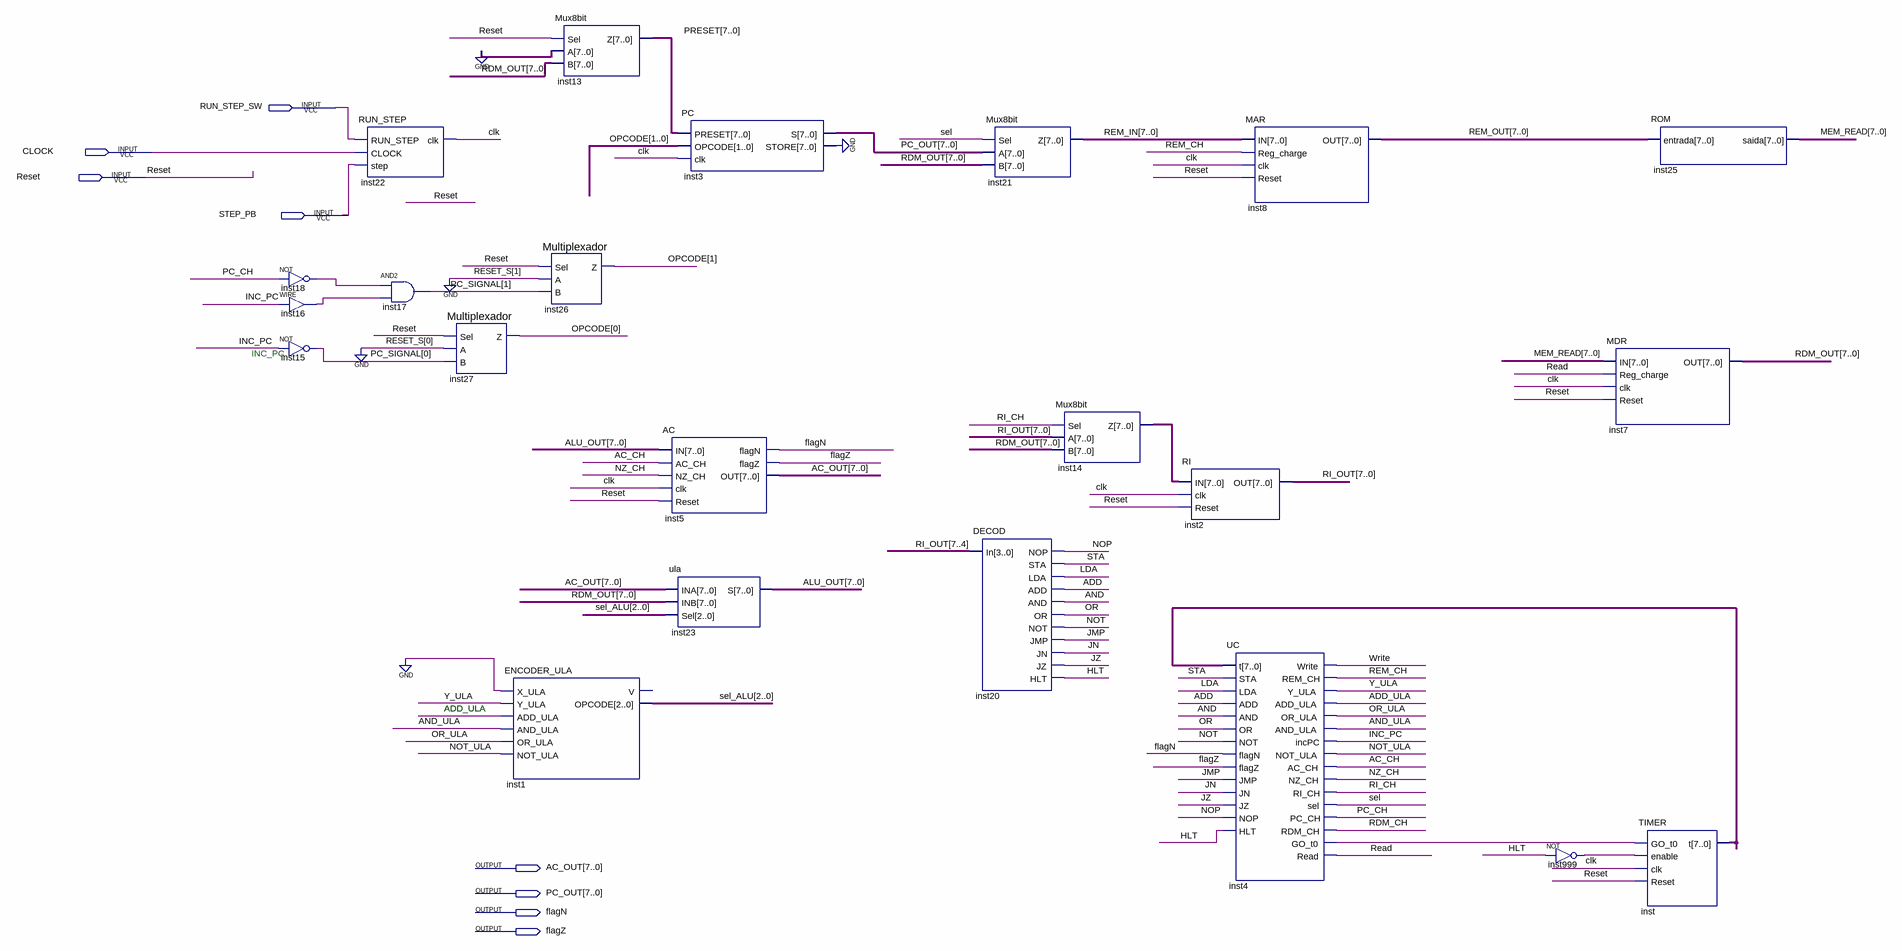
[diagram p0: schematic sheet]
// Quartus schematic NEANDER.bdf as structural Verilog: 22 symbols, 8 pins
module NEANDER (
  input  RUN_STEP_SW,
  input  CLOCK,
  input  Reset,
  input  STEP_PB,
  output [7:0] AC_OUT,
  output [7:0] PC_OUT,
  output flagN,
  output flagZ
);

  wire AC_CH, ADD, ADD_ULA, AND, AND_ULA, clk, HLT, INC_PC, inst4_go_t0, inst16_out, inst18_out, inst999_out,
       JMP, JN, JZ, LDA, NOP, NOT, NOT_ULA, NZ_CH, OR, OR_ULA, PC_CH, RDM_CH, Read, REM_CH, RI_CH, sel, STA,
       Write, Y_ULA;
  wire [1:0] OPCODE, PC_SIGNAL;
  wire [2:0] sel_ALU;
  wire [7:0] ALU_OUT, inst3_store, inst14_z, inst_t, MEM_READ, PRESET, RDM_OUT, REM_IN, REM_OUT, RI_OUT;

  not inst18 (inst18_out, PC_CH);
  assign inst16_out = INC_PC;  // WIRE inst16
  not inst15 (PC_SIGNAL[0], INC_PC);
  RUN_STEP inst22 (.RUN_STEP(RUN_STEP_SW), .CLOCK(CLOCK), .step(STEP_PB), .clk(clk));
  and inst17 (PC_SIGNAL[1], inst18_out, inst16_out);
  Multiplexador inst27 (.Sel(Reset), .A(1'b0), .B(PC_SIGNAL[0]), .Z(OPCODE[0]));
  ENCODER_ULA inst1 (
    .X_ULA(1'b0), .Y_ULA(Y_ULA), .ADD_ULA(ADD_ULA), .AND_ULA(AND_ULA), .OR_ULA(OR_ULA), .NOT_ULA(NOT_ULA),
    .OPCODE(sel_ALU));  // open: V
  Mux8bit inst13 (.Sel(Reset), .A({8{1'b0}}), .B(RDM_OUT), .Z(PRESET));
  Multiplexador inst26 (.Sel(Reset), .A(1'b0), .B(PC_SIGNAL[1]), .Z(OPCODE[1]));
  PC inst3 (.PRESET(PRESET), .OPCODE(OPCODE), .clk(clk), .S(PC_OUT), .STORE(inst3_store));
  AC inst5 (
    .IN(ALU_OUT), .AC_CH(AC_CH), .NZ_CH(NZ_CH), .clk(clk), .Reset(Reset), .flagN(flagN), .flagZ(flagZ),
    .OUT(AC_OUT));
  ula inst23 (.INA(AC_OUT), .INB(RDM_OUT), .Sel(sel_ALU), .S(ALU_OUT));
  Mux8bit inst21 (.Sel(sel), .A(PC_OUT), .B(RDM_OUT), .Z(REM_IN));
  DECOD inst20 (
    .In(RI_OUT[7:4]), .NOP(NOP), .STA(STA), .LDA(LDA), .ADD(ADD), .AND(AND), .OR(OR), .NOT(NOT), .JMP(JMP),
    .JN(JN), .JZ(JZ), .HLT(HLT));
  Mux8bit inst14 (.Sel(RI_CH), .A(RI_OUT), .B(RDM_OUT), .Z(inst14_z));
  RI inst2 (.IN(inst14_z), .clk(clk), .Reset(Reset), .OUT(RI_OUT));
  MAR inst8 (.IN(REM_IN), .Reg_charge(REM_CH), .clk(clk), .Reset(Reset), .OUT(REM_OUT));
  UC inst4 (
    .t(inst_t), .STA(STA), .LDA(LDA), .ADD(ADD), .AND(AND), .OR(OR), .NOT(NOT), .flagN(flagN), .flagZ(flagZ),
    .JMP(JMP), .JN(JN), .JZ(JZ), .NOP(NOP), .HLT(HLT), .Write(Write), .REM_CH(REM_CH), .Y_ULA(Y_ULA),
    .ADD_ULA(ADD_ULA), .OR_ULA(OR_ULA), .AND_ULA(AND_ULA), .incPC(INC_PC), .NOT_ULA(NOT_ULA), .AC_CH(AC_CH),
    .NZ_CH(NZ_CH), .RI_CH(RI_CH), .sel(sel), .PC_CH(PC_CH), .RDM_CH(RDM_CH), .GO_t0(inst4_go_t0), .Read(Read));
  not inst999 (inst999_out, HLT);
  MDR inst7 (.IN(MEM_READ), .Reg_charge(Read), .clk(clk), .Reset(Reset), .OUT(RDM_OUT));
  ROM inst25 (.entrada(REM_OUT), .saida(MEM_READ));
  TIMER inst (.GO_t0(inst4_go_t0), .enable(inst999_out), .clk(clk), .Reset(Reset), .t(inst_t));
  // also tied to GND on the sheet: {inst3_store[0], inst3_store[1], inst3_store[2], inst3_store[3], inst3_store[4], inst3_store[5], inst3_store[6], inst3_store[7]}

  // Notes on the sheet:
  //   INC_PC
  //   ADD_ULA
endmodule
